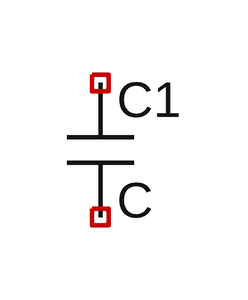
[diagram p0: schematic Test.asc]
Test.asc, the LTspice schematic file:
Version 4
SHEET 1 880 680
SYMBOL cap 160 80 R0
SYMATTR InstName C1

The netlist it stands for:
* Test.asc
C1 NC_01 NC_02 C
.backanno
.end